# Altium schematic sheet TSAC_Logic.SchDoc: TSAL_Inverter Enclosure
size 420 x 297 mm; Date: 23/04/24; DrawnBy: Georgios Papandreou; Revision: 4; SheetNumber: 3; SheetTotal: 4; CarNum: E5; CurrentSheet: 3; Totalsheet: 3
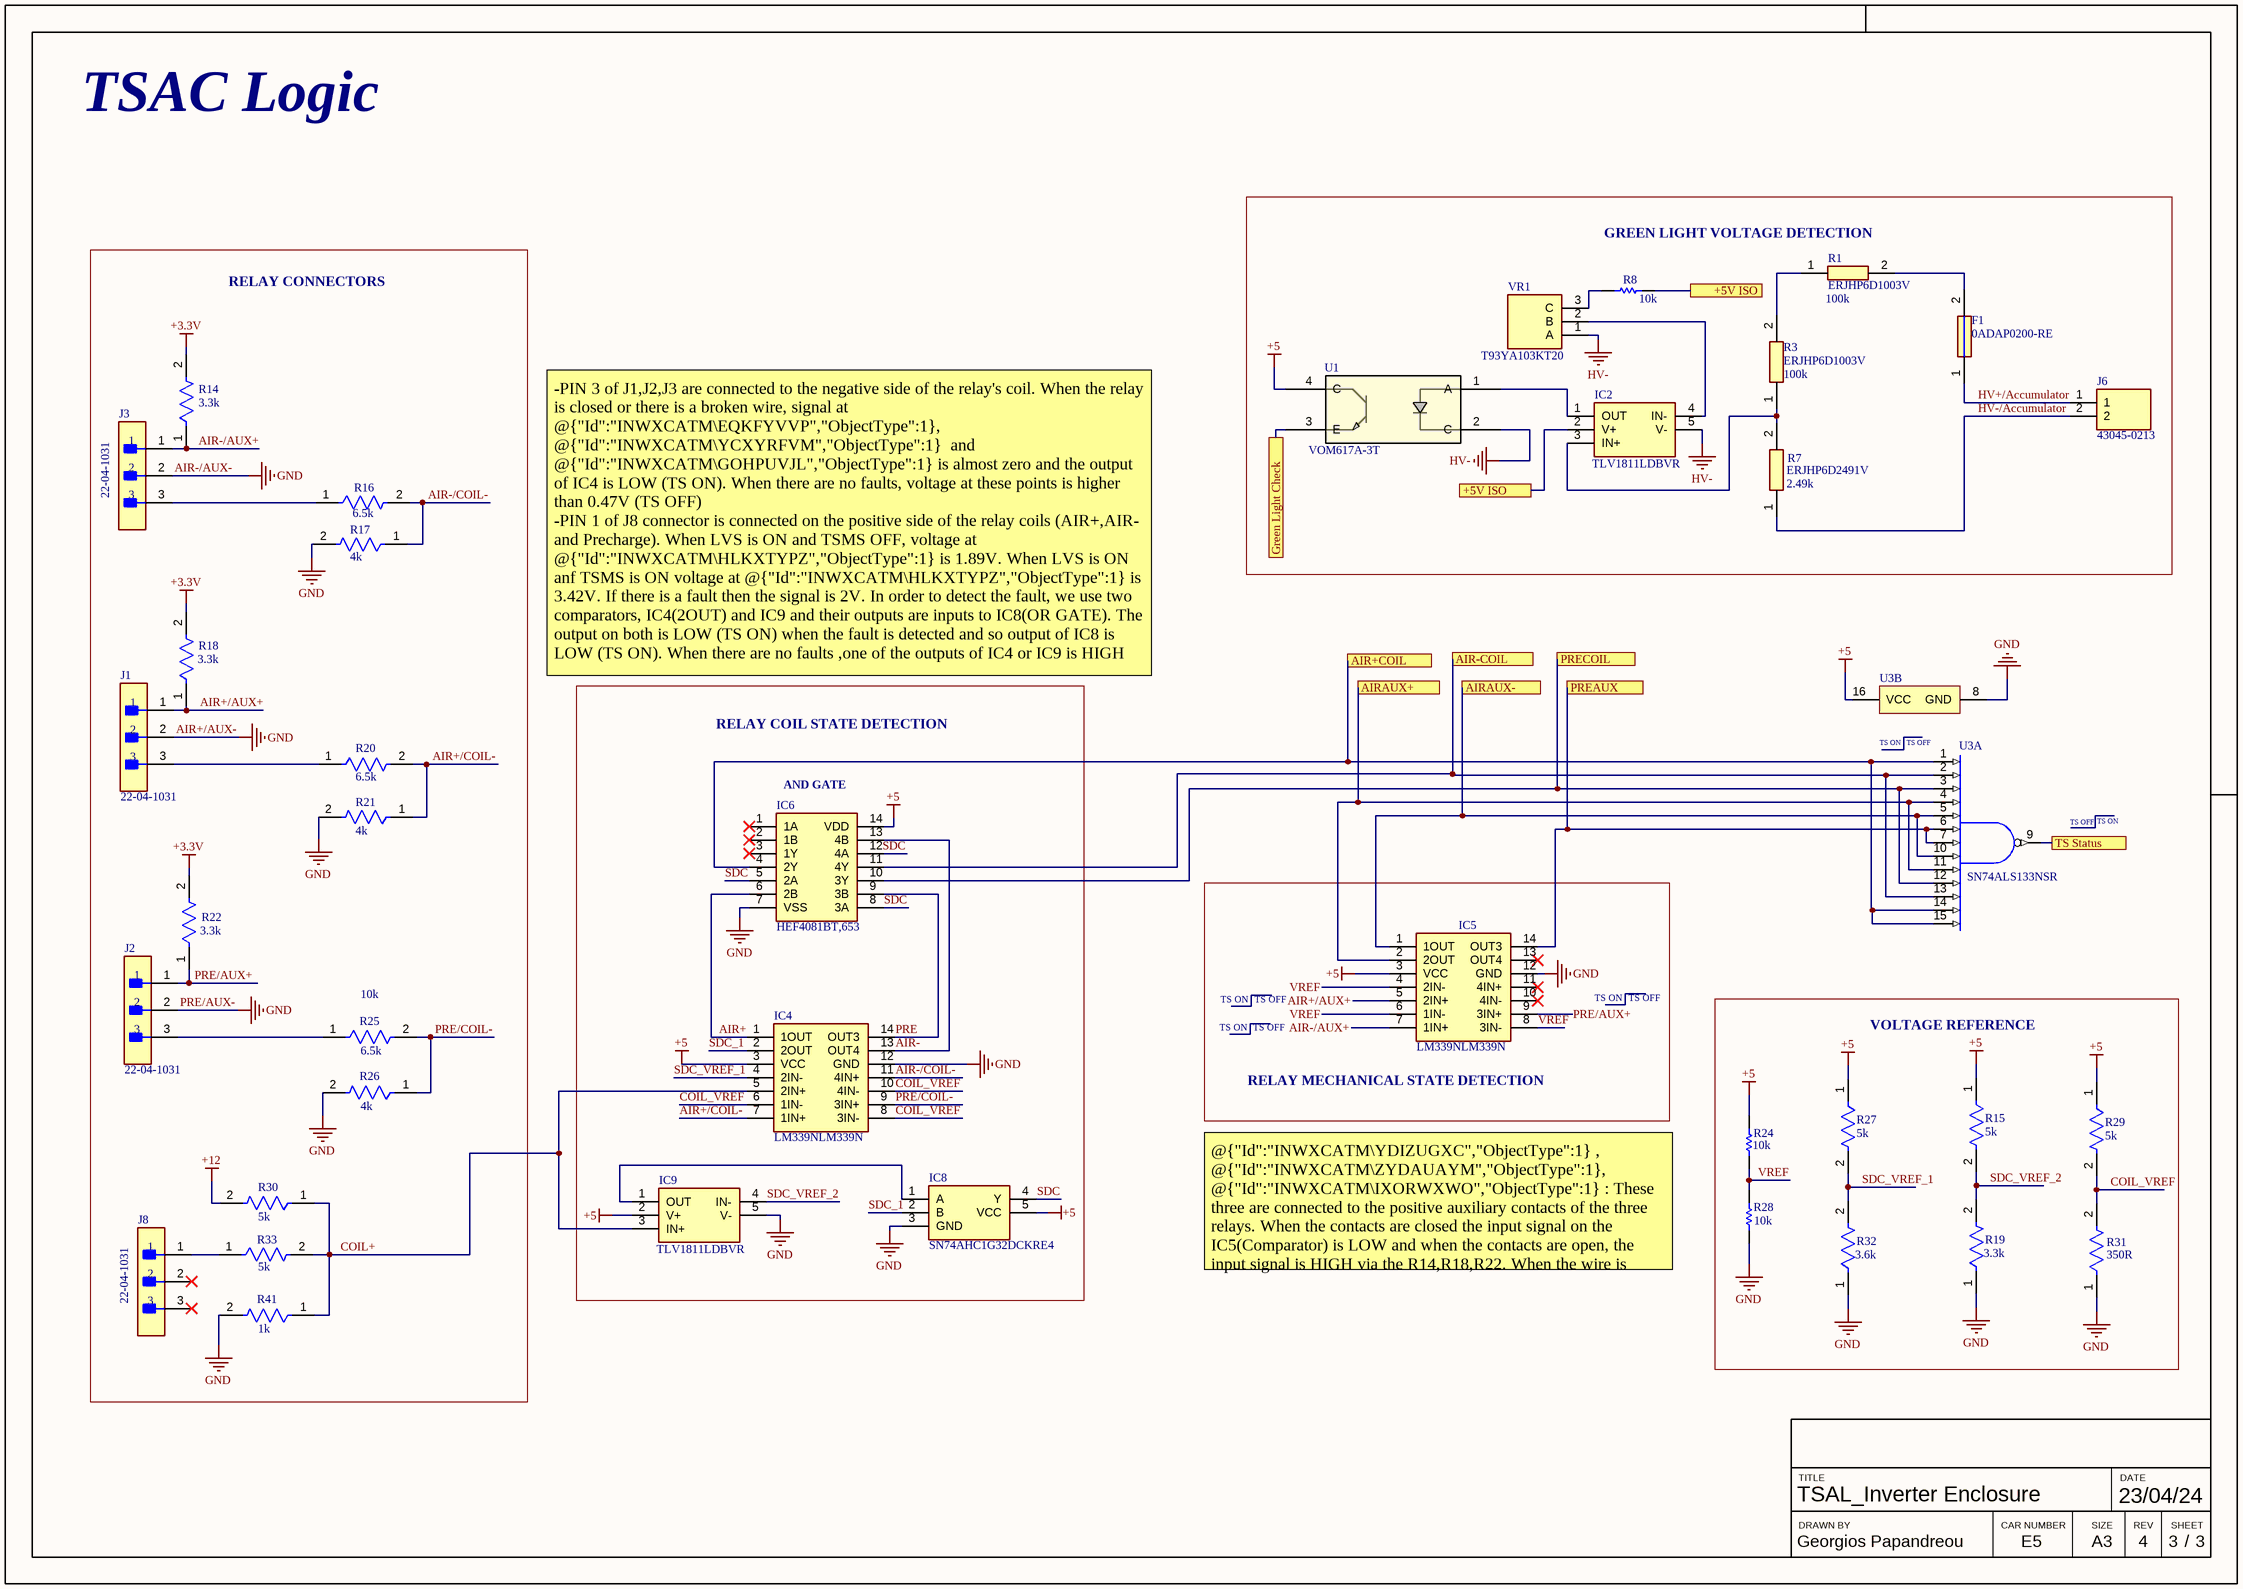
[diagram p0: TSAC_Logic.SchDoc]

## Parts
F1  0ADAP0200-RE  [0ADAP0200RE]
IC2  TLV1811LDBVR  [SOT95P280X145-5N]
IC4  LM339NLM339N  [DIP794W53P254L1930H508Q14N]
IC5  LM339NLM339N  [DIP794W53P254L1930H508Q14N]
IC6  HEF4081BT,653  [SOIC127P600X175-14N]
IC8  SN74AHC1G32DCKRE4  [SOT65P210X110-5N]
IC9  TLV1811LDBVR  [SOT95P280X145-5N]
J1  22-04-1031  [FP-22-04-1031-MFG]
J2  22-04-1031  [FP-22-04-1031-MFG]
J3  22-04-1031  [FP-22-04-1031-MFG]
J6  43045-0213  [43045-02YY_121314]
J8  22-04-1031  [FP-22-04-1031-MFG]
R1  ERJHP6D1003V  [ERJHP6D1000V]
R3  ERJHP6D1003V  [ERJHP6D1000V]
R7  ERJHP6D2491V  [ERJHP6D1000V]
R8  CRCW080510K0FKEC  [RESC2013X50X30ML20T20]  (value not drawn)
R14  CRCW08053K30FKEC  [FP-CRCW0805-e3-MFG]  (value not drawn)
R15  CRCW080520K0JNEB  [FP-CRCW0805-e3-IPC_B]  (value not drawn)
R16  CRCW120610K0FKEA  [FP-CRCW1206-e3-IPC_C]  (value not drawn)
R17  RN732BTTD4001B25  [FP-RN732B-IPC_C]  (value not drawn)
R18  CRCW08053K30FKEC  [FP-CRCW0805-e3-MFG]  (value not drawn)
R19  CRCW120610K0FKEA  [FP-CRCW1206-e3-IPC_C]  (value not drawn)
R20  CRCW120610K0FKEA  [FP-CRCW1206-e3-IPC_C]  (value not drawn)
R21  RN732BTTD4001B25  [FP-RN732B-IPC_C]  (value not drawn)
R22  CRCW08053K30FKEC  [FP-CRCW0805-e3-MFG]  (value not drawn)
R24  CRCW080510K0FKEC  [RESC2013X50X30ML20T20]  (value not drawn)
R25  CRCW120610K0FKEA  [FP-CRCW1206-e3-IPC_C]  (value not drawn)
R26  RN732BTTD4001B25  [FP-RN732B-IPC_C]  (value not drawn)
R27  CRCW080520K0JNEB  [FP-CRCW0805-e3-IPC_B]  (value not drawn)
R28  CRCW080510K0FKEC  [RESC2013X50X30ML20T20]  (value not drawn)
R29  CRCW080520K0JNEB  [FP-CRCW0805-e3-IPC_B]  (value not drawn)
R30  CRCW080520K0JNEB  [FP-CRCW0805-e3-IPC_B]  (value not drawn)
R31  MCA12060D8000BP500  [FP-MCA1206-IPC_C]  (value not drawn)
R32  CRCW120610K0FKEA  [FP-CRCW1206-e3-IPC_C]  (value not drawn)
R33  CRCW120610K0FKEA  [FP-CRCW1206-e3-IPC_C]  (value not drawn)
R41  RN732BTTD4001B25  [FP-RN732B-IPC_C]  (value not drawn)
U1  VOM617A-3T  [SMD-4_VOM617A_VIS]
U3  SN74ALS133NSR  [NS0016A_M]  (parts A,B of 2)
VR1  T93YA103KT20  [T93YA5K10]

## Blocks framed on the sheet
GREEN LIGHT VOLTAGE DETECTION: F1 IC2 J6 R1 R3 R7 R8 U1 VR1
RELAY CONNECTORS: J1-J3 J8 R14 R16-R18 R20-R22 R25 R26 R30 R33 R41
RELAY COIL STATE DETECTION: IC4 IC6 IC8 IC9
RELAY MECHANICAL STATE DETECTION: IC5
VOLTAGE REFERENCE: R15 R19 R24 R27-R29 R31 R32

## Ports
+5V ISO (see Green_Light_Check[5B], Red_Light_Check[3C], Red_Light_Check[4B], TSAC_Logic[4B]), +5V ISO (see Green_Light_Check[5B], Red_Light_Check[3C], Red_Light_Check[4B], TSAC_Logic[5A]), AIR+COIL (see Green_Light_Check[2D]), AIR-COIL (see Green_Light_Check[2D]), AIRAUX+ (see Green_Light_Check[2D]), AIRAUX- (see Green_Light_Check[2D]), Green Light Check (see Green_Light_Check[3D], Green_Light_Check[4C]), PREAUX (see Green_Light_Check[3D]), PRECOIL (see Green_Light_Check[3D]), TS Status (see Green_Light_Check[3D], Green_Light_Check[4C])

## Nets
+3.3V: R14.2 R18.2 R22.2
+5: IC4.3(VCC) IC5.3(VCC) IC6.14(VDD) IC8.5(VCC) IC9.2(V+) R15.1 R24.2 R27.1 R29.1 U1.4(C) U3.16(VCC)
+12: R30.2
AIR+/AUX-: IC4.12(GND) IC5.12(GND) IC6.7(VSS) IC8.3(GND) IC9.5(V-) J1.2 J2.2 J3.2 R17.2 R19.1 R21.2 R26.2 R28.1 R31.1 R32.1 R41.2 U3.8(GND)  [also labelled AIR-/AUX-, GND, PRE/AUX-]
HV-: IC2.5(V-) U1.2(C) VR1.1(A)
+5V ISO: IC2.2(V+) R8.1 ; port +5V ISO
AIR+: IC4.1(1OUT) IC6.6(2B)
AIR+/AUX+: IC5.5(2IN+) J1.1 R18.1
AIR+/COIL-: IC4.7(1IN+) R20.2 R21.1
AIR+COIL: IC6.4(2Y) U3.1(A) U3.14(L) U3.15(M) ; port AIR+COIL
AIR-: IC4.13(OUT4) IC6.13(4B)
AIR-/AUX+: IC5.7(1IN+) J3.1 R14.1
AIR-/COIL-: IC4.11(4IN+) R16.2 R17.1
AIR-COIL: IC6.11(4Y) U3.2(B) U3.13(K) ; port AIR-COIL
AIRAUX+: IC5.2(2OUT) U3.4(D) U3.11(I) ; port AIRAUX+
AIRAUX-: IC5.1(1OUT) U3.5(E) U3.10(H) ; port AIRAUX-
COIL+: IC4.5(2IN+) IC9.3(IN+) R30.1 R33.2 R41.1
COIL_VREF: IC4.6(1IN-) IC4.8(3IN-) IC4.10(4IN-) R29.2 R31.2
Green Light Check: U1.3(E) ; port Green Light Check
HV+/Accumulator: F1.1 J6.1
HV-/Accumulator: J6.2 R7.1
PRE: IC4.14(OUT3) IC6.9(3B)
PRE/AUX+: IC5.9(3IN+) J2.1 R22.1
PRE/COIL-: IC4.9(3IN+) R25.2 R26.1
PREAUX: IC5.14(OUT3) U3.6(F) U3.7(G) ; port PREAUX
PRECOIL: IC6.10(3Y) U3.3(C) U3.12(J) ; port PRECOIL
SDC: IC6.5(2A) IC6.8(3A) IC6.12(4A) IC8.4(Y)
SDC_1: IC4.2(2OUT) IC8.2(B)
SDC_VREF_1: IC4.4(2IN-) R27.2 R32.2
SDC_VREF_2: IC9.4(IN-) R15.2 R19.2
TS Status: U3.9(Y) ; port TS Status
VREF: IC5.4(2IN-) IC5.6(1IN-) IC5.8(3IN-) R24.1 R28.2
NetF1_2: F1.2 R1.2
NetIC2_1: IC2.1(OUT) U1.1(A)
NetIC2_3: IC2.3(IN+) R3.1 R7.2
NetIC2_4: IC2.4(IN-) VR1.2(B)
NetIC8_1: IC8.1(A) IC9.1(OUT)
NetJ1_3: J1.3 R20.1
NetJ2_3: J2.3 R25.1
NetJ3_3: J3.3 R16.1
NetJ8_1: J8.1 R33.1
NetR1_1: R1.1 R3.2
NetR8_2: R8.2 VR1.3(C)

Not connected (* = marked no-connect by the designer): IC5 10(4IN-)* 11(4IN+)* 13(OUT4)*; IC6 1(1A)* 2(1B)* 3(1Y)*; J8 2* 3*

## Notes on the sheet
- TSAC Logic
- (near R8) 10k
- (near R1) 100k
- (near R3) 100k
- (near R14) 3.3k
- (near R16) 6.5k
- (near R7) 2.49k
- (near R17) 4k
- (near R18) 3.3k
- -PIN 3 of J1,J2,J3 are connected to the negative side of the relay's coil. When the relay is closed or there is a broken wire, signal at @{"Id":"INWXCATM\EQKFYVVP","ObjectType":1}, @{"Id":"INWXCATM\YCXYRFVM","ObjectType":1}  and @{"Id":"INWXCATM\GOHPUVJL","ObjectType":1} is almost zero and the output of IC4 is LOW (TS ON). When there are no faults, voltage at these points is higher than 0.47V (TS OFF)
  -PIN 1 of J8 connector is connected on the positive side of the relay coils (AIR+,AIR- and Precharge). When LVS is ON and TSMS OFF, voltage at @{"Id":"INWXCATM\HLKXTYPZ","ObjectType":1} is 1.89V. When LVS is ON anf TSMS is ON voltage at @{"Id":"INWXCATM\HLKXTYPZ","ObjectType":1} is 3.42V. If there is a fault then the signal is 2V. In order to detect the fault, we use two comparators, IC4(2OUT) and IC9 and their outputs are inputs to IC8(OR GATE). The output on both is LOW (TS ON) when the fault is detected and so output of IC8 is LOW (TS ON). When there are no faults ,one of the outputs of IC4 or IC9 is HIGH and thus IC8 is HIGH.
  -Outputs from IC8 and IC4 are inputs to IC6 (AND GATE). When there are no faults, all inputs are HIGH and thus output is HIGH so TS is OFF. If there is a fault or at least one relay is closed, output of IC6 is LOW so TS is ON.
- (near R20) 6.5k
- (near IC6) AND GATE
- (near U3) TS ON
- (near U3) TS OFF
- (near R21) 4k
- TS OFF
- TS ON
- (near R22) 3.3k
- (near R25) 10k
- (near R25) 6.5k
- (near R26) 4k
- (near R27) 5k
- (near R15) 5k
- (near R29) 5k
- (near R24) 10k
- (near R30) 5k
- (near R33) 5k
- @{"Id":"INWXCATM\YDIZUGXC","ObjectType":1} , @{"Id":"INWXCATM\ZYDAUAYM","ObjectType":1}, @{"Id":"INWXCATM\IXORWXWO","ObjectType":1} : These three are connected to the positive auxiliary contacts of the three relays. When the contacts are closed the input signal on the IC5(Comparator) is LOW and when the contacts are open, the input signal is HIGH via the R14,R18,R22. When the wire is broken, the input is also HIGH.
- (near R28) 10k
- (near R32) 3.6k
- (near R19) 3.3k
- (near R31) 350R
- (near R41) 1k
- TITLE
- DATE
- DRAWN BY
- CAR NUMBER
- SIZE
- REV
- SHEET
- A3
- /

## Library data of the parts
F1 = 0ADAP0200-RE: Fuse; Manufacturer_Name: BelFuse; Datasheet Link: https://www.belfuse.com/resources/datasheets/circuitprotection/ds-cp-0adax-series.pdf; Height: 7.06mm; Manufacturer_Part_Number: 0ADAP0200-RE; Mouser Part Number: 530-0ADAP0200-RE; Mouser Price/Stock: https://www.mouser.co.uk/ProductDetail/Bel-Fuse/0ADAP0200-RE?qs=chTDxNqvsylLbV%252B5gr9f%252Bw%3D%3D; Arrow Part Number: 0ADAP0200-RE; Arrow Price/Stock: https://www.arrow.com/en/products/0adap0200-re/bel-group
IC2 IC9 = TLV1811LDBVR: Integrated Circuit; Manufacturer_Name: Texas Instruments; Datasheet Link: https://www.ti.com/lit/ds/symlink/tlv1811.pdf?ts=1674252464539&ref_url=https%253A%252F%252Fwww.ti.com%252Fproduct%252FTLV1811; Height: 1.45mm; Manufacturer_Part_Number: TLV1811LDBVR; Mouser Part Number: 595-TLV1811LDBVR; Mouser Price/Stock: https://www.mouser.co.uk/ProductDetail/Texas-Instruments/TLV1811LDBVR?qs=rQFj71Wb1eX09MzTfpxERg%3D%3D; Arrow Part Number: TLV1811LDBVR; Arrow Price/Stock: https://www.arrow.com/en/products/tlv1811ldbvr/texas-instruments?region=nac
IC4 IC5 = LM339N: Integrated Circuit; Manufacturer_Name: Texas Instruments; Datasheet Link: https://componentsearchengine.com/Datasheets/2/LM339N.pdf; Height: 5.08mm; Manufacturer_Part_Number: LM339N; Mouser Part Number: 595-LM339N; Mouser Price/Stock: https://www.mouser.co.uk/ProductDetail/Texas-Instruments/LM339N?qs=rshUhwi3fbY%252BaR%252BOl3edNw%3D%3D; Arrow Part Number: LM339N; Arrow Price/Stock: https://www.arrow.com/en/products/lm339n/texas-instruments?region=nac
IC6 = HEF4081BT,653: Integrated Circuit; Manufacturer_Name: Nexperia; Datasheet Link: https://assets.nexperia.com/documents/data-sheet/HEF4081B.pdf; Height: 1.75mm; Manufacturer_Part_Number: HEF4081BT,653; Mouser Part Number: 771-HEF4081BTD-T; Mouser Price/Stock: https://www.mouser.co.uk/ProductDetail/Nexperia/HEF4081BT653?qs=me8TqzrmIYWQmKgk7FpcUw%3D%3D; Arrow Part Number: HEF4081BT,653; Arrow Price/Stock: https://www.arrow.com/en/products/hef4081bt653/nexperia?region=europe
IC8 = SN74AHC1G32DCKRE4: Integrated Circuit; Manufacturer_Name: Texas Instruments; Datasheet Link: https://www.arrow.com/en/products/sn74ahc1g32dckre4/texas-instruments; Height: 1.1mm; Manufacturer_Part_Number: SN74AHC1G32DCKRE4; Mouser Part Number: 595-74AHC1G32DCKRE4; Mouser Price/Stock: https://www.mouser.co.uk/ProductDetail/Texas-Instruments/SN74AHC1G32DCKRE4?qs=fSCvMSq5ISXKX2gb0IHBGA%3D%3D; Arrow Part Number: SN74AHC1G32DCKRE4; Arrow Price/Stock: https://www.arrow.com/en/products/sn74ahc1g32dckre4/texas-instruments
J1-J3 J8 = CMP-04776-000410-1: CONN HEADER VERT 3POS 2.5MM; Voltage Rating (AC): 250V; Number of Contacts: 3; Max Voltage Rating (DC): 250.25kV; Contact Resistance: 20mR; Hole Diameter: 1.19mm; Gender: Male; Connector Type: Male Pin; Insulation Resistance: 1GR; Glow Wire Compliant: Non-compliant; Current Rating: 3A; Contact Material: Brass; Series: KK; Number of Positions: 3; Contact Gender: Male; Mount: Through Hole; Working Voltage: 250V; Number of Poles: 3; Termination: Solder; Radiation Hardening: No; Lead Free: Lead Free; Min Operating Temperature: -40°C; Contact Mating Length: 0.295inch; Packaging: Bulk; Lead Pitch: 2.5mm; Voltage Rating: 250V; Voltage Rating (DC): 250V; Orientation: Straight; Color: Natural; Flammability Rating: UL94 V-0; Housing Material: Nylon; Pitch: 2.5mm; Contact Type: Male Pin; Number of Rows: 1; Housing Color: Natural; Max Operating Temperature: 105°C; Fastening Type: Friction; Halogen Free: Low Halogen; Contact Plating: Tin; Package Quantity: 1; Number of Circuits: 3
J6 = 43045-0213: Connector; Manufacturer_Name: Molex; Datasheet Link: https://www.molex.com/pdm_docs/sd/430450612_sd.pdf; Height: 9.91mm; Manufacturer_Part_Number: 43045-0213; Mouser Part Number: 538-43045-0213; Mouser Price/Stock: https://www.mouser.co.uk/ProductDetail/Molex/43045-0213?qs=4XSMV6Twtb2ziNgaS7IgsA%3D%3D
R1 R3 = ERJHP6D1003V: Resistor; Manufacturer_Name: Panasonic; Datasheet Link: http://industrial.panasonic.com/cdbs/www-data/pdf/RDQ0000/ast-ind-151033.pdf; Height: 0.7mm; Manufacturer_Part_Number: ERJHP6D1003V
R7 = ERJHP6D2491V: Resistor; Manufacturer_Name: Panasonic; Datasheet Link: http://industrial.panasonic.com/cdbs/www-data/pdf/RDQ0000/ast-ind-151033.pdf; Height: 0.7mm; Manufacturer_Part_Number: ERJHP6D2491V
R8 R24 R28 = CMP-1013-00623-2: Manufacturer: Vishay Dale; Part Number: CRCW080510K0FKEC
R14 R18 R22 = CMP-02407-006791-1: RES Thick Film, 3.3kΩ, 1%, 0.125W, 100ppm/°C, 0805; Resistance: 3.3kR; Max Power Dissipation: 125mW; Width: 0.049inch; Height: 0.02inch; Contact Plating: Tin; Package Quantity: 20000; Features: Automotive AEC-Q200; Max Operating Temperature: 155°C; Packaging: Tape and Reel; Composition: Thick Film; Temperature Coefficient: 100ppm/°C; Tolerance: 1%; Number of Terminations: 2; Radiation Hardening: No; Length: 0.079inch; Lead Free: Lead Free; Min Operating Temperature: -55°C; Case/Package: 0805
R15 R27 R29 R30 = CMP-02407-010660-1: RES Thick Film, 20kΩ, 5%, 0.125W, 200ppm/°C, 0805; Voltage Rating: 150V; Resistance: 20kR; Max Power Dissipation: 125mW; Case/Package: 0805; Number of Terminations: 2; Features: Automotive AEC-Q200; Tolerance: 5%; Height: 0.02inch; Case Code (Metric): 2012; Temperature Coefficient: 200ppm/°C; Max Operating Temperature: 155°C; Min Operating Temperature: -55°C; Length: 0.079inch; Weight: 0.000194oz; Case Code (Imperial): 0805; Composition: Thick Film; Width: 1.25mm; Lead Free: Lead Free; Power Rating: 125mW; Packaging: Tape and Reel; Termination: SMD/SMT; Package Quantity: 10000
R16 R19 R20 R25 R32 R33 = CMP-2003-04807-2: RES Thick Film, 10kΩ, 1%, 0.25W, 100ppm/°C, 1206; Working Voltage: 200V; Max Power Dissipation: 250mW; Resistance: 10kR; Tolerance: 1%; Width: 0.063inch; Height: 0.55mm; Number of Pins: 2; Voltage Rating: 200V; Temperature Coefficient: 100ppm/°C; Military Standard: Not; Features: Automotive AEC-Q200; Depth: 1.6mm; Radiation Hardening: No; Termination: SMD/SMT; Case Code (Imperial): 1206; Weight: 0.000353oz; Length: 3.2mm; Package Quantity: 10; Voltage Rating (DC): 200V; Case/Package: 1206; Min Operating Temperature: -55°C; Number of Terminations: 2; Composition: Thick Film; Contact Plating: Tin; Power Rating: 250mW; Packaging: Tape and Reel; Max Operating Temperature: 155°C; Lead Free: Lead Free; Case Code (Metric): 3216
R17 R21 R26 R41 = CMP-04015-032713-1: 4kΩ ±0.1% 0.125W, 1/8W Chip Resistor 1206 (3216 Metric) Moisture Resistant Thin Film; Temperature Coefficient: 25ppm/°C; Power Rating: 125mW; Voltage Rating: 150V; Resistance: 4kR; Length: 3.2mm; Termination: SMD/SMT; Case/Package: 1206; Composition: Thin Film; Min Operating Temperature: -55°C; Packaging: Tape and Reel; Width: 1.6mm; Case Code (Metric): 3216; Case Code (Imperial): 1206; Tolerance: 0.1%; Height: 0.6mm; Max Operating Temperature: 125°C; Weight: 0.000571oz
R31 = CMP-02407-008722-1: Res MC Precision Thin Film 1206 800Ω 0.1% 0.25W ±25ppm/°C Molded Paper T/R; Resistance: 800R; Max Power Dissipation: 250mW; Lead Free: Lead Free; Package Quantity: 5000; Composition: Thin Film; Tolerance: 0.1%; Number of Terminations: 2; Length: 0.126inch; Width: 0.063inch; Max Operating Temperature: 125°C; Packaging: Tape and Reel; Min Operating Temperature: -55°C; Case/Package: 1206; Temperature Coefficient: 25ppm/°C; Height: 0.026inch
U1 = CMP-00030-45523145-1: VOM617A-3T Transistor Output Optocoupler, 1-Element, 3750V Isolation; Isolation Voltage: 3.75kV; Max Power Dissipation: 170mW; Max Output Voltage: 80V; Output Current per Channel: 100mA; Collector Emitter Saturation Voltage: 400mV; Number of Elements: 1; Max Input Current: 60mA; Fall Time: 12µs; Rise Time: 7µs; Forward Voltage: 1.6V; Current Transfer Ratio: 200%; Reverse Breakdown Voltage: 6V; Lead Free: Lead Free; Case/Package: SOP; Mount: Surface Mount; Min Operating Temperature: -55°C; Radiation Hardening: No; Width: 3.85mm; REACH SVHC: Unknown; Schedule B: 8541408000, 8541408000; Number of Pins: 4; Collector Emitter Breakdown Voltage: 80V; Forward Current: 60mA; Number of Channels: 1; RoHS: Compliant; Power Dissipation: 170mW; NexarPartId: 45523145; Length: 4.4mm; Input Current: 60mA; Collector Emitter Voltage (VCEO): 80V; Max Operating Temperature: 110°C; Output Voltage: 80V; Packaging: Tape & Reel; Max Collector Current: 100mA; Height: 2mm; Reverse Voltage (DC): 6V
U3 = CMP-1627-00566-2: 13-Input Positive-NAND Gates, NS0016A, LARGE T&R; Manufacturer: Texas Instruments; Output Drive (IOL/IOH)(Max)(mA): 0.4/-8; Voltage(Nom)(V): 5; Technology Family: ALS; tpd @ Nom Voltage(Max)(ns): 25; Input Type: TTL; VCC(Max)(V): 5.5; VCC(Min)(V): 4.5; Schmitt Trigger: No; Bits(#): 1; F @ Nom Voltage(Max)(Mhz): 75; ICC @ Nom Voltage(Max)(mA): 0.00034; Rating: Catalog; PackageReference: NS0016A; Generic Part Number: SN74ALS133; DatasheetVersion: SDAS202B; Output Type: TTL; Operating Temperature Range(C): 0 to 70
VR1 = T93YA103KT20: Variable Resistor; Manufacturer_Name: Vishay; Datasheet Link: https://www.vishay.com/docs/51026/t93.pdf; Height: 9mm; Manufacturer_Part_Number: T93YA103KT20; Mouser Part Number: 72-T93YA-10K; Mouser Price/Stock: https://www.mouser.co.uk/ProductDetail/Vishay-Sfernice/T93YA103KT20?qs=h4f6qdGYbthXcbdd7vDO0Q%3D%3D; Arrow Part Number: T93YA103KT20; Arrow Price/Stock: https://www.arrow.com/en/products/t93ya103kt20/vishay?region=nac